# Altium schematic sheet Comu_485.SchDoc
size A4; DocumentNumber: 5; SheetNumber: 5; SheetTotal: 11
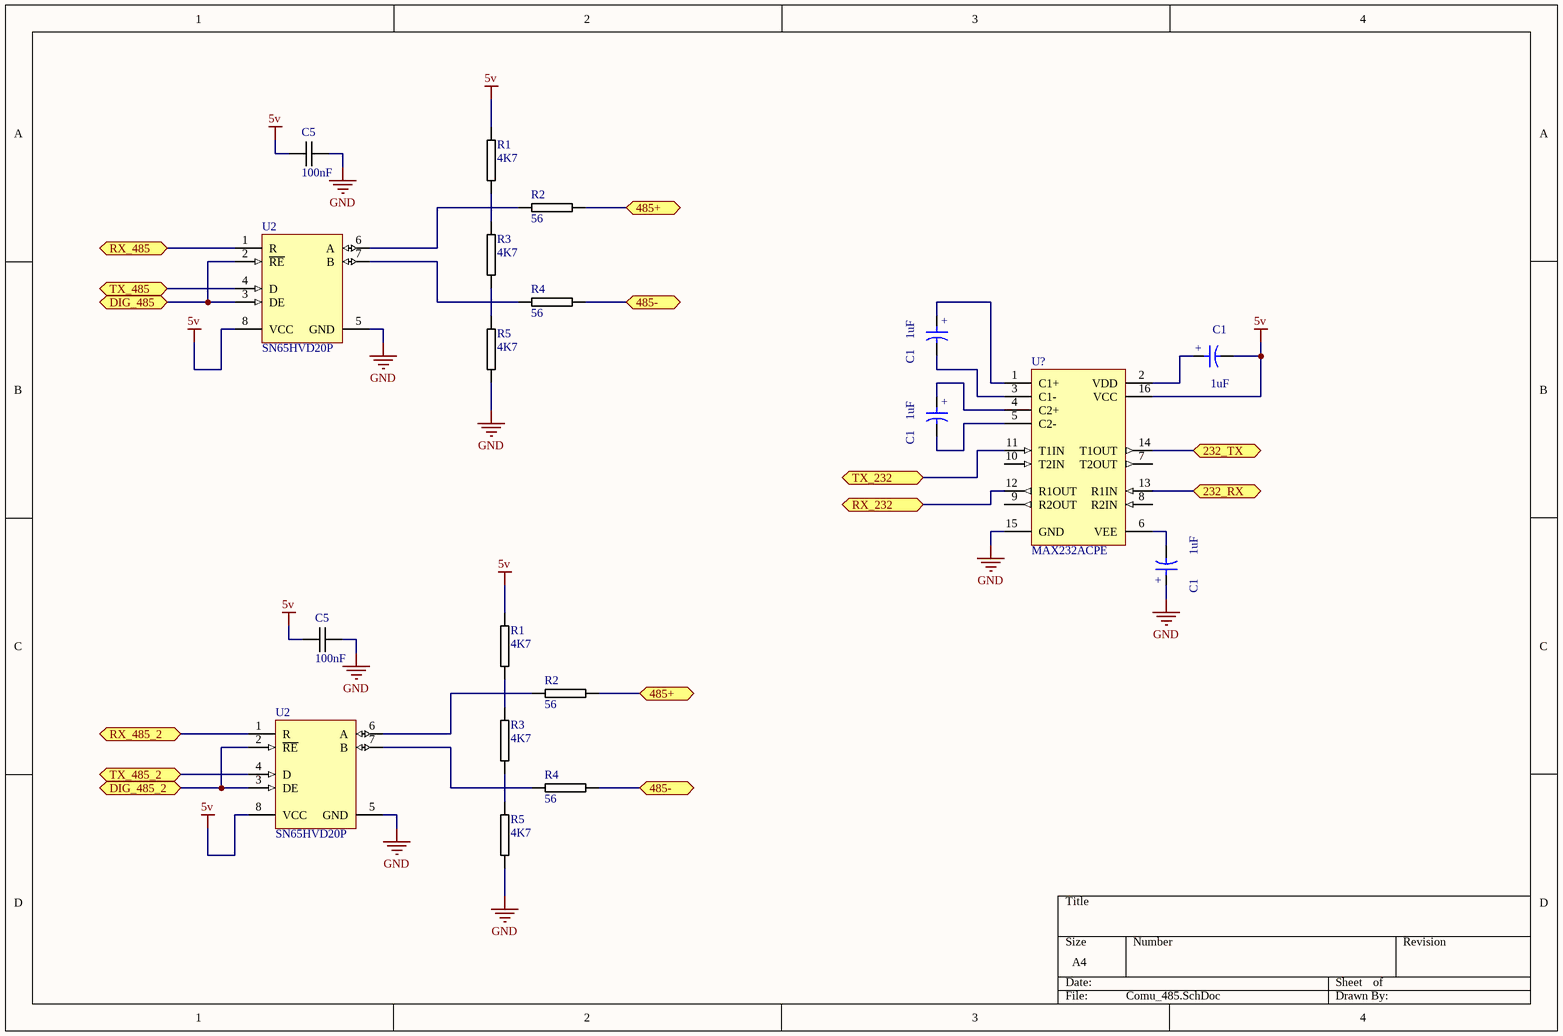
[diagram p0: Comu_485.SchDoc]

## Parts
(Parts that share a designator on the sheet are numbered #1, #2 ... from top to bottom, then left to right.)
C1#1  1uF  [CAPPRB254-450X710]
C1#2  1uF  [CAPPRB254-450X710]
C1#3  1uF  [CAPPRB254-450X710]
C1#4  1uF  [CAPPRB254-450X710]
C5#1  100nF  [0805C-TBD]
C5#2  100nF  [0805C-TBD]
R1#1  4K7  [0805R-4K7]
R1#2  4K7  [0805R-4K7]
R2#1  56  [0805R-56]
R2#2  56  [0805R-56]
R3#1  4K7  [0805R-4K7]
R3#2  4K7  [0805R-4K7]
R4#1  56  [0805R-56]
R4#2  56  [0805R-56]
R5#1  4K7  [0805R-4K7]
R5#2  4K7  [0805R-4K7]
U2#1  SN65HVD20P  [P8]
U2#2  SN65HVD20P  [P8]
U?  MAX232ACPE  [PE16A]

## Ports
232_RX, 232_TX, 485+, 485-, DIG_485 (bidir), DIG_485_2 (bidir), RX_232, RX_485, RX_485_2, TX_232, TX_485 (bidir), TX_485_2 (bidir)

## Nets
5v: C1#2.2 C5#1.1 C5#2.1 R1#1.1 R1#2.1 U2#1.8(VCC) U2#2.8(VCC) U?.16(VCC)
GND: C1#4.1 C5#1.2 C5#2.2 R5#1.2 R5#2.2 U2#1.5(GND) U2#2.5(GND) U?.15(GND)
232_RX: U?.13(R1IN) ; port 232_RX
232_TX: U?.14(T1OUT) ; port 232_TX
485+: R2#1.2 R2#2.2 ; port 485+
485-: R4#1.2 R4#2.2 ; port 485-
DIG_485: U2#1.2(~{RE}) U2#1.3(DE) ; port DIG_485
DIG_485_2: U2#2.2(~{RE}) U2#2.3(DE) ; port DIG_485_2
RX_232: U?.12(R1OUT) ; port RX_232
RX_485: U2#1.1(R) ; port RX_485
RX_485_2: U2#2.1(R) ; port RX_485_2
TX_232: U?.11(T1IN) ; port TX_232
TX_485: U2#1.4(D) ; port TX_485
TX_485_2: U2#2.4(D) ; port TX_485_2
NetC1#1_1: C1#1.1 U?.1(C1+)
NetC1#1_2: C1#1.2 U?.3(C1-)
NetC1#2_1: C1#2.1 U?.2(VDD)
NetC1#3_1: C1#3.1 U?.4(C2+)
NetC1#3_2: C1#3.2 U?.5(C2-)
NetC1#4_2: C1#4.2 U?.6(VEE)
NetR1#1_2: R1#1.2 R3#1.1
NetR1#2_2: R1#2.2 R3#2.1
NetR2#1_1: R2#1.1 U2#1.6(A)
NetR2#2_1: R2#2.1 U2#2.6(A)
NetR3#1_2: R3#1.2 R5#1.1
NetR3#2_2: R3#2.2 R5#2.1
NetR4#1_1: R4#1.1 U2#1.7(B)
NetR4#2_1: R4#2.1 U2#2.7(B)

Not connected (* = marked no-connect by the designer): U? 7(T2OUT) 8(R2IN) 9(R2OUT) 10(T2IN)

## Notes on the sheet
- (in symbol CTEB_1UF_35V_10%_254-450X710) +

## Library data of the parts
C1#1-C1#4 = CTEB_1UF_35V_10%_254-450X710: Polarised capacitor; Part Description: Solid Tantalum Resin Dipped Capacitor; Manufacturer: KEMET; Manufacturer Part Number: T350A105K035AT; Voltage: 35V; Tolerance: ±10%; Table: Capacitors THD; Part Number: CTEB_1UF_35V_10%_254-450X710; Component Kind: Standard; Component Type: Standard; Pin Count: 2; Value: 1uF; Status: None; Case: LS2.54 D4.5 x H7.1; Mounted: Yes; Socket: No; SMD: No; ComponentHeight: 7.1mm; HelpURL: \\cern.ch\dfs\Applications\Altium\Datasheets\CTEB_KEMET_T350.pdf; Author: CERN DEM JLC; CreateDate: 16/12/2009; LatestRevisionDate: 16/12/2009
C5#1 C5#2 = 0805C-100nF-25V-X7R-MUR: CAPACITOR 0805 CERAMIC; Supplier 1: Digi-Key; Supplier Part Number 1: 490-1673-1-ND
R1#1 R1#2 R3#1 R3#2 R5#1 R5#2 = 0805R-4K7: RESISTOR 0805 1/4 WATT THIN FILM; Reel: *
R2#1 R2#2 R4#1 R4#2 = 0805R-56: RESISTOR 0805 1/4 WATT THIN FILM; Reel: *
U2#1 U2#2 = SN65HVD20P: Extended Common-mode RS-485 Transceiver, 25 Mbps, 5 V, Half Duplex, -40 to 85 degC, 8-pin PDIP (P), Pb-Free (RoHS); Manufacturer: Texas Instruments; Eco-Plan: Green (RoHS & no Sb/Br); # of TX/RX: 1 TX / 1 RX; Drivers Per Package: 1; Isolated: No; Number of Nodes: 64; Signaling Rate(Mbps): 25; Common Mode Range: -20 to 25; ESD(kV): 16; Fault Protection(V): -27 to 27; Fail Safe: Idle, Open, Short; ICC(Max)(mA): 9; Supply Voltage(s)(V): 5; Rating: Catalog; DatasheetVersion: SLLS552E; PackageVersion: revE, Apr-2010; PackageReference: P8; PackageDescription: 8-Pin Plastic Dual-In-Line Package, Row Spacing 7.62 mm, Pitch 2.54 mm; Supplier 1: Digi-Key; Supplier Part Number 1: SN65HVD20P-ND; Supplier 2: Mouser; Supplier Part Number 2: 595-SN65HVD20P; SubFamily: RS-485; Receivers Per Package: 1; Duplex: Half; Footprint: SN75176; Mounting Technology: Through-hole; PartNumber: SN65HVD20P; Code_JEDEC: MS-001-BA; ComponentLink1Description: Datasheet; ComponentLink1URL: http://www.ti.com/general/docs/lit/getliterature.tsp?genericPartNumber=SN65HVD20&fileType=pdf; ComponentLink2Description: Package Specification; ComponentLink2URL: http://www.ti.com/litv/pdf/mpdi001b
U? = MAX232ACPE: +5V Powered, Multi-Channel RS-232 Driver/Receiver; Published: 16-Jan-2001; LatestRevisionDate: 29-May-2009; LatestRevisionNote: Component Body Added.; PackageVersion: 1997; PackageReference: PE16A; Publisher: Altium Limited; PackageDescription: DIP, 16-Pin, Row Spacing 7.62 mm, Pitch 2.54 mm; Code_JEDEC: MS-001-BB; ComponentLink1Description: Manufacturer Link; ComponentLink1URL: http://www.maxim-ic.com/; ComponentLink2Description: Datasheet; ComponentLink2URL: http://pdfserv.maxim-ic.com/en/ds/MAX220-MAX249.pdf